# Altium schematic sheet LTC3554.SchDoc
size A4; SheetNumber: 3; SheetTotal: 3
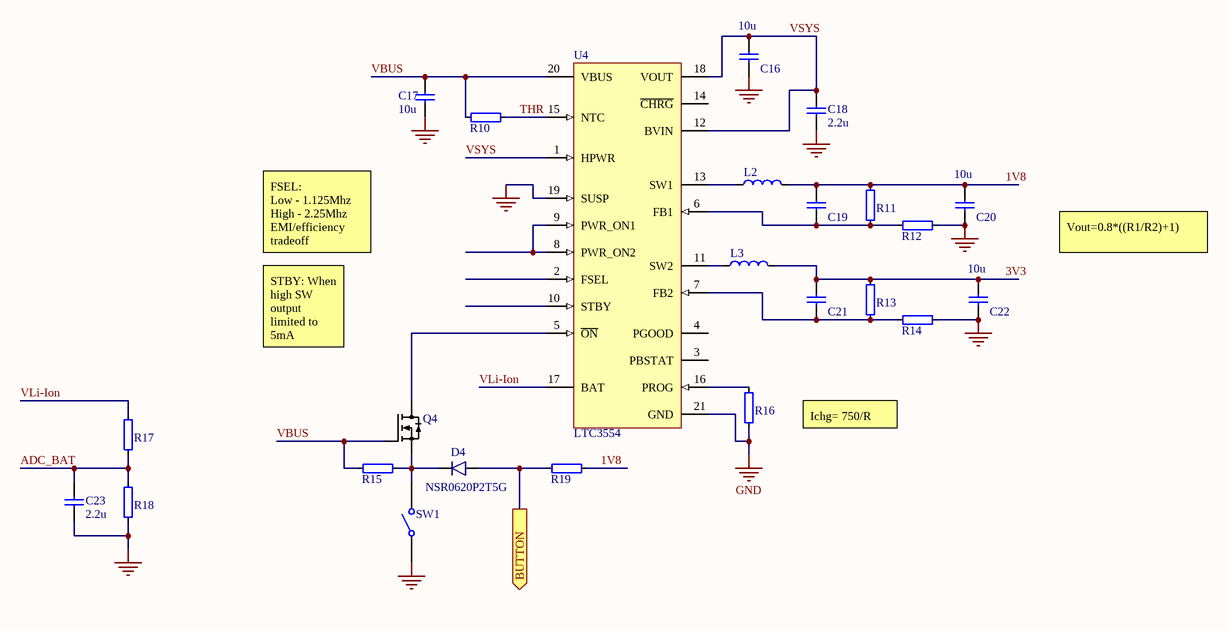
[diagram p0: LTC3554.SchDoc]

## Parts
C16  10u  [CAPC1608X06L]
C17  10u  [CAPC1608X06L]
C18  2.2u  [CAPC1005X04L]
C19  10p  [CAPC0603X03L_C]  (value not drawn)
C20  10u  [CAPC1608X06L]
C21  10p  [CAPC0603X03L_C]  (value not drawn)
C22  10u  [CAPC1608X06L]
C23  2.2u  [CAPC1005X04L]
D4  NSR0620P2T5G  [SODFL100X40-2N]
L2  LQM21DH100M70L  [FP-LQM21DH_70-MFG]  (value not drawn)
L3  PE-0805CLH4R7STS  [L0805]  (value not drawn)
Q4  RV2C010UNT2L  [DFN65P100X40-3L]  (value not drawn)
R10  R0201  [RESC0603X03L_C]  (value not drawn)
R11  1.5M  [RESC0603X03L_C]  (value not drawn)
R12  1.2M  [RESC0603X03L_C]  (value not drawn)
R13  1.5M  [RESC0603X03L_C]  (value not drawn)
R14  475k  [RESC0603X03L_C]  (value not drawn)
R15  10K  [RESC0603X03L_C]  (value not drawn)
R16  1.5k  [RESC0603X03L_C]  (value not drawn)
R17  1M  [RESC0603X03L_C]  (value not drawn)
R18  510k  [RESC0603X03L_C]  (value not drawn)
R19  10K  [RESC0603X03L_C]  (value not drawn)
SW1  434123050816  [434123050816]  (value not drawn)
U4  LTC3554  [LT-UD-20_L]

## Ports
BUTTON (out)

## Nets
GND: C16.1 C17.1 C18.1 C20.1 C22.1 C23.1 R12.1 R14.1 R16.1 R18.2 SW1.1 U4.19(SUSP) U4.21(GND)
1V8: C19.2 C20.2 L2.2 R11.2 R19.1
3V3: C21.2 C22.2 L3.2 R13.2
ADC_BAT: C23.2 R17.2 R18.1
BUTTON: D4.2(A) R19.2 ; port BUTTON
THR: R10.1 U4.15(NTC)
VBUS: C17.2 Q4.1(G) R10.2 R15.2 U4.20(VBUS)
VLi-Ion: R17.1 U4.17(BAT)
VSYS: C16.2 C18.2 U4.1(HPWR) U4.12(BVIN) U4.18(VOUT)
NetC19_1: C19.1 R11.1 R12.2 U4.6(FB1)
NetC21_1: C21.1 R13.1 R14.2 U4.7(FB2)
NetD4_1: D4.1(C) Q4.2(S) R15.1 SW1.2
NetL2_1: L2.1 U4.13(SW1)
NetL3_1: L3.1 U4.11(SW2)
NetQ4_3: Q4.3(D) U4.5(~{ON})
NetR16_2: R16.2 U4.16(PROG)
NetU4_8: U4.8(PWR_ON2) U4.9(PWR_ON1)

Not connected (* = marked no-connect by the designer): U4 2(FSEL) 3(PBSTAT) 4(PGOOD) 10(STBY) 14(~{CHRG})

## Notes on the sheet
- FSEL:
  Low - 1.125Mhz
  High - 2.25Mhz
  EMI/efficiency tradeoff
- Vout=0.8*((R1/R2)+1)
- STBY: When high SW output limited to 5mA
- Ichg= 750/R

## Library data of the parts
C16 C17 C20 C22 = C0603
C18 C23 = C0402
C19 C21 = C0201
D4 = NSR0620P2T5G: 20V schottky barrier diode, Vf 350 mV @ 100 mA, Ir 2.0 µA @ 10 V, If 500 mA; Manufacturer: ON Semiconductor; Part number IPS: 00000009952; Note: N.A.; Artikkelnr Noca: 10029169; Pad Count: 2; Part Number: NSR0620P2T5G; Manufacturer Part Number: NSR0620P2T5G; LatestRevisionDate: 2016-07-07; Published: 2016-07-07; Value: NSR0620P2T5G; Footprint Doc: SOD-923; ComponentLink1URL: N.A.; ComponentLink1Description: Datasheet; ComponentLink2URL: N.A.; ComponentLink2Description: Supplier link; HelpURL: http://www.onsemi.com/pub_link/Collateral/NSR0620P2-D.PDF; Supplier 1: Digi-Key; Supplier Part Number 1: NSR0620P2T5GOSCT-ND; Supplier 2: N.A.; Supplier Part Number 2: N.A.; Component Class: Semiconductors; PartId: 101300131
L2 = LQM21DH100M70L: Inductor Power Chip Shielded Multi-Layer 10uH 20% 1MHz Ferrite 0.3A 0.845Ohm DCR 0805 Automotive T/R; Manufacturer: Murata; Supplier 1: Mouser; Manufacturer Part Number: LQM21DH100M70L; RoHS: No; Category: Fixed Inductors; Stock 1: 80712; Pricing 1: 1=0.27000, 10=0.18200, 50=0.18200, 100=0.15200, 1000=0.10900, 10000=0.09200 (USD); Supplier Part Number 1: 81-LQM21DH100M70L
L3 = PE-0805CLH4R7STS: wire wound chip inductor, 4, 700.00 nh, +/-20%, 25 mHz, RoHS; Manufacturer: Pulse; Supplier 1: Mouser; Manufacturer Part Number: PE-0805CLH4R7STS; RoHS: Yes; Category: Fixed Inductors; Stock 1: 20462; Pricing 1: 1=0.28000, 10=0.21900, 50=0.21900, 100=0.16500, 1000=0.12600, 10000=0.09100 (USD); Supplier Part Number 1: 673-PE-0805CLH4R7STS
Q4 = RV2C010UNT2L: MOSFET Transistor, N Channel, 1 A, 20 V, 0.34 ohm, 4.5 V, 1 V RoHS Compliant: Yes; Manufacturer: Rohm; Drain to Source Voltage (Vdss): 20V; Continuous Drain Current (ID): 1A; Rds On Max: 470mR; Input Capacitance: 40pF; Max Power Dissipation: 400mW; Threshold Voltage: 1V; Resistance: 0.34R; Supplier 1: Mouser; Manufacturer Part Number: RV2C010UNT2L; RoHS: Yes; Category: MOSFETs; Stock 1: 3031; Pricing 1: 1=0.39000, 10=0.25100, 50=0.25100, 100=0.16500, 500=0.10900, 1000=0.08400, 2500=0.07700, 10000=0.07700 (USD); Mount: Surface Mount; Number of Pins: 1006; Max Operating Temperature: 150°C; Packaging: Cut Tape; REACH SVHC: No SVHC; RoHS Compliant: Yes; ComponentLink1URL: http://www.farnell.com/datasheets/1945594.pdf?src-supplier=Farnell; ComponentLink1Description: http://www.farnell.com/datasheets/1945594.pdf?src-supplier=Farnell; ComponentLink2URL: http://www.mouser.com/ds/2/348/rv2c010un-e-1139137.pdf?src-supplier=Mouser; ComponentLink2Description: http://www.mouser.com/ds/2/348/rv2c010un-e-1139137.pdf?src-supplier=Mouser; ComponentLink3URL: http://rohmfs.rohm.com/en/techdata_basic/transistor/taping/VML1006_T2L_taping.pdf?src-supplier=Digi-Key; ComponentLink3Description: http://rohmfs.rohm.com/en/techdata_basic/transistor/taping/VML1006_T2L_taping.pdf?src-supplier=Digi-Key; ComponentLink4URL: http://www.rohm.com/web/global/datasheet/RV2C010UN/rv2c010un-e?src-supplier=Digi-Key; ComponentLink4Description: http://www.rohm.com/web/global/datasheet/RV2C010UN/rv2c010un-e?src-supplier=Digi-Key; ComponentLink5URL: http://rohmfs.rohm.com/en/products/databook/datasheet/discrete/transistor/mosfet/rv2c010unt2l.pdf?src-supplier=Avnet; ComponentLink5Description: http://rohmfs.rohm.com/en/products/databook/datasheet/discrete/transistor/mosfet/rv2c010unt2l.pdf?src-supplier=Avnet; ComponentLink6URL: http://www.farnell.com/datasheets/1945594.pdf?src-supplier=Element14; ComponentLink6Description: http://www.farnell.com/datasheets/1945594.pdf?src-supplier=Element14; Supplier Part Number 1: 755-RV2C010UNT2L
R11-R19 = R0201
SW1 = 434123050816: Switch Tactile Spst-no 0.05A 12V; Manufacturer: Wurth Electronics; Mechanical Life: 50000Cycles; Actuator Material: Polymer,Liquid Crystal Polymer; Operating Force: 160gf; Contact Resistance: 100mR; Contact Current Rating: 50mA; Illumination Type: Non-Illuminated,Illuminated; Throw Configuration: SPST; Switch Travel: 0.25mm; Switch Function: Off-Mom; Actuator Length: 1.5mm; Supplier 1: Mouser; Manufacturer Part Number: 434123050816; RoHS: Yes; Category: Tactile Switches; Stock 1: 2599; Pricing 1: 1=0.54000, 10=0.54000, 50=0.54000, 100=0.54000, 750=0.43300, 1000=0.43300, 1500=0.36700, 10000=0.36700 (USD); Mount: Surface Mount; Contact Material: Stainless Steel,Steel; Min Operating Temperature: -40°C; Max Operating Temperature: 85°C; Current Rating: 50mA; Packaging: Tape and Reel; Termination: Solder; Insulation Resistance: 100MR; Series: WS-TASV; Contact Type: 1 maker; Length: 7.2mm; Width: 3.5mm; Height: 5mm; REACH SVHC: No SVHC; Lead Free: Lead Free; RoHS Compliant: Yes; ComponentLink1URL: https://datasheet.ciiva.com/1532/434123043816-1532528.pdf?src-supplier=Element14; ComponentLink1Description: https://datasheet.ciiva.com/1532/434123043816-1532528.pdf?src-supplier=Element14; ComponentLink2URL: https://datasheet.ciiva.com/30466/0900766b8126b636-30466780.pdf?src-supplier=RSComponents; ComponentLink2Description: https://datasheet.ciiva.com/30466/0900766b8126b636-30466780.pdf?src-supplier=RSComponents; ComponentLink3URL: https://datasheet.ciiva.com/29123/711760-da-01-en-taster-434123050816-29123824.pdf?src-supplier=Conrad; ComponentLink3Description: https://datasheet.ciiva.com/29123/711760-da-01-en-taster-434123050816-29123824.pdf?src-supplier=Conrad; ComponentLink4URL: https://datasheet.ciiva.com/1633/434123043816-1633968.pdf?src-supplier=Farnell; ComponentLink4Description: https://datasheet.ciiva.com/1633/434123043816-1633968.pdf?src-supplier=Farnell; ComponentLink5URL: https://datasheet.ciiva.com/22695/434123043816-22695550.pdf?src-supplier=Element14; ComponentLink5Description: https://datasheet.ciiva.com/22695/434123043816-22695550.pdf?src-supplier=Element14; Supplier Part Number 1: 710-434123050816
U4 = LTC3554EUD#PBF: IC USB POWER MANAGER 20UTQFN; Manufacturer: Analog Devices / Linear Technology; Operating Supply Current: 10uA; Max Input Voltage: 5.5V; Min Input Voltage: 4.35V; Number of Cells: 1; Number of Outputs: 2; Supplier 1: Mouser; Manufacturer Part Number: LTC3554EUD#PBF; RoHS: Yes; Category: Power Management ICs; Stock 1: 1043; Pricing 1: 1=6.36000, 10=5.75000, 50=5.48000, 100=4.76000, 1000=4.13000, 10000=3.77000 (USD); Case/Package: QFN; Number of Pins: 20; Min Operating Temperature: -40°C; Max Operating Temperature: 85°C; Package Quantity: 121; Packaging: Rail/Tube; Series: PowerPath™; Operating Supply Voltage: 5.5V; Length: 3mm; Radiation Hardening: No; RoHS Compliant: Yes; REACH SVHC: No SVHC; ComponentLink1URL: https://datasheet.ciiva.com/1644/1726404-1644763.pdf?src-supplier=Newark; ComponentLink1Description: https://datasheet.ciiva.com/1644/1726404-1644763.pdf?src-supplier=Newark; ComponentLink2URL: https://datasheet.ciiva.com/1512/1712336-1512448.pdf?src-supplier=Element14; ComponentLink2Description: https://datasheet.ciiva.com/1512/1712336-1512448.pdf?src-supplier=Element14; ComponentLink3URL: https://datasheet.ciiva.com/15104/getdatasheetpartid-447198-15104413.pdf?src-supplier=Verical; ComponentLink3Description: https://datasheet.ciiva.com/15104/getdatasheetpartid-447198-15104413.pdf?src-supplier=Verical; ComponentLink4URL: https://datasheet.ciiva.com/1964/27687-1964823.pdf?src-supplier=Digi-Key; ComponentLink4Description: https://datasheet.ciiva.com/1964/27687-1964823.pdf?src-supplier=Digi-Key; Supplier Part Number 1: 584-LTC3554EUD#PBF